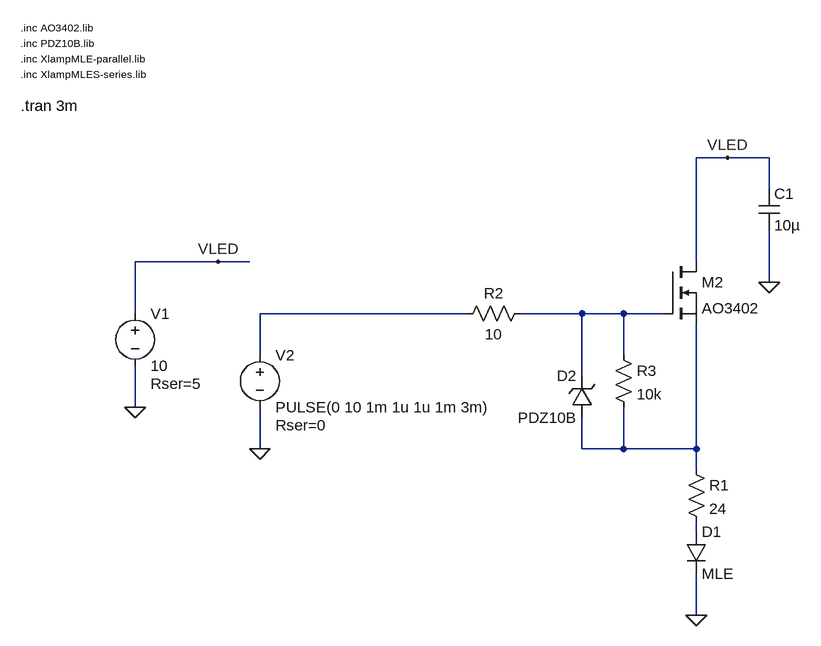
[diagram p0: schematic led-drive-ciruit.asc]
led-drive-ciruit.asc, the LTspice schematic file:
Version 4
SHEET 1 1144 680
WIRE 928 -192 880 -192
WIRE 992 -192 928 -192
WIRE 992 -144 992 -192
WIRE 144 -32 16 -32
WIRE 192 -32 144 -32
WIRE 880 -32 880 -192
WIRE 992 0 992 -80
WIRE 16 48 16 -32
WIRE 528 48 208 48
WIRE 704 48 608 48
WIRE 768 48 704 48
WIRE 832 48 768 48
WIRE 208 112 208 48
WIRE 768 112 768 48
WIRE 704 144 704 48
WIRE 16 192 16 128
WIRE 208 256 208 192
WIRE 704 256 704 208
WIRE 768 256 768 192
WIRE 768 256 704 256
WIRE 880 256 880 64
WIRE 880 256 768 256
WIRE 880 288 880 256
WIRE 880 384 880 368
WIRE 880 512 880 448
FLAG 16 192 0
FLAG 144 -32 VLED
FLAG 208 256 0
FLAG 928 -192 VLED
FLAG 880 512 0
FLAG 992 0 0
SYMBOL voltage 16 32 R0
WINDOW 123 0 0 Left 2
WINDOW 39 24 124 Left 2
SYMATTR InstName V1
SYMATTR Value 10
SYMATTR SpiceLine Rser=5
SYMBOL nmos 832 -32 R0
SYMATTR InstName M2
SYMATTR Value AO3402
SYMATTR Prefix X
SYMBOL voltage 208 96 R0
WINDOW 123 0 0 Left 2
WINDOW 39 24 124 Left 2
SYMATTR InstName V2
SYMATTR Value PULSE(0 10 1m 1u 1u 1m 3m)
SYMATTR SpiceLine Rser=0
SYMBOL diode 864 384 R0
SYMATTR InstName D1
SYMATTR Value MLE
SYMBOL zener 720 208 R180
WINDOW 0 24 64 Left 2
WINDOW 3 24 0 Left 2
SYMATTR InstName D2
SYMATTR Value PDZ10B
SYMBOL res 864 272 R0
SYMATTR InstName R1
SYMATTR Value 24
SYMBOL res 624 32 R90
WINDOW 0 0 56 VBottom 2
WINDOW 3 32 56 VTop 2
SYMATTR InstName R2
SYMATTR Value 10
SYMBOL cap 976 -144 R0
SYMATTR InstName C1
SYMATTR Value 10µ
SYMBOL res 752 96 R0
SYMATTR InstName R3
SYMATTR Value 10k
TEXT -160 -392 Left 1 !.inc AO3402.lib
TEXT -160 -368 Left 1 !.inc PDZ10B.lib
TEXT -160 -344 Left 1 !.inc XlampMLE-parallel.lib
TEXT -160 -320 Left 1 !.inc XlampMLES-series.lib
TEXT -160 -272 Left 2 !.tran 3m

The netlist it stands for:
* led-drive-ciruit.asc
V1 VLED 0 10 Rser=5
XM2 VLED N002 N003 AO3402  ; pins D G S
V2 N001 0 PULSE(0 10 1m 1u 1u 1m 3m) Rser=0
D1 N004 0 MLE
D2 N003 N002 PDZ10B
R1 N003 N004 24
R2 N002 N001 10
C1 VLED 0 10µ
R3 N002 N003 10k
.model D D
.lib standard.dio
.inc AO3402.lib
.inc PDZ10B.lib
.inc XlampMLE-parallel.lib
.inc XlampMLES-series.lib
.tran 3m
.backanno
.end